# Altium schematic sheet Power.SchDoc: Power Supply
size B; Revision: B01; SheetNumber: 2; SheetTotal: 5; ProjectCodeName: HiFive1; ProjectName: Cinque
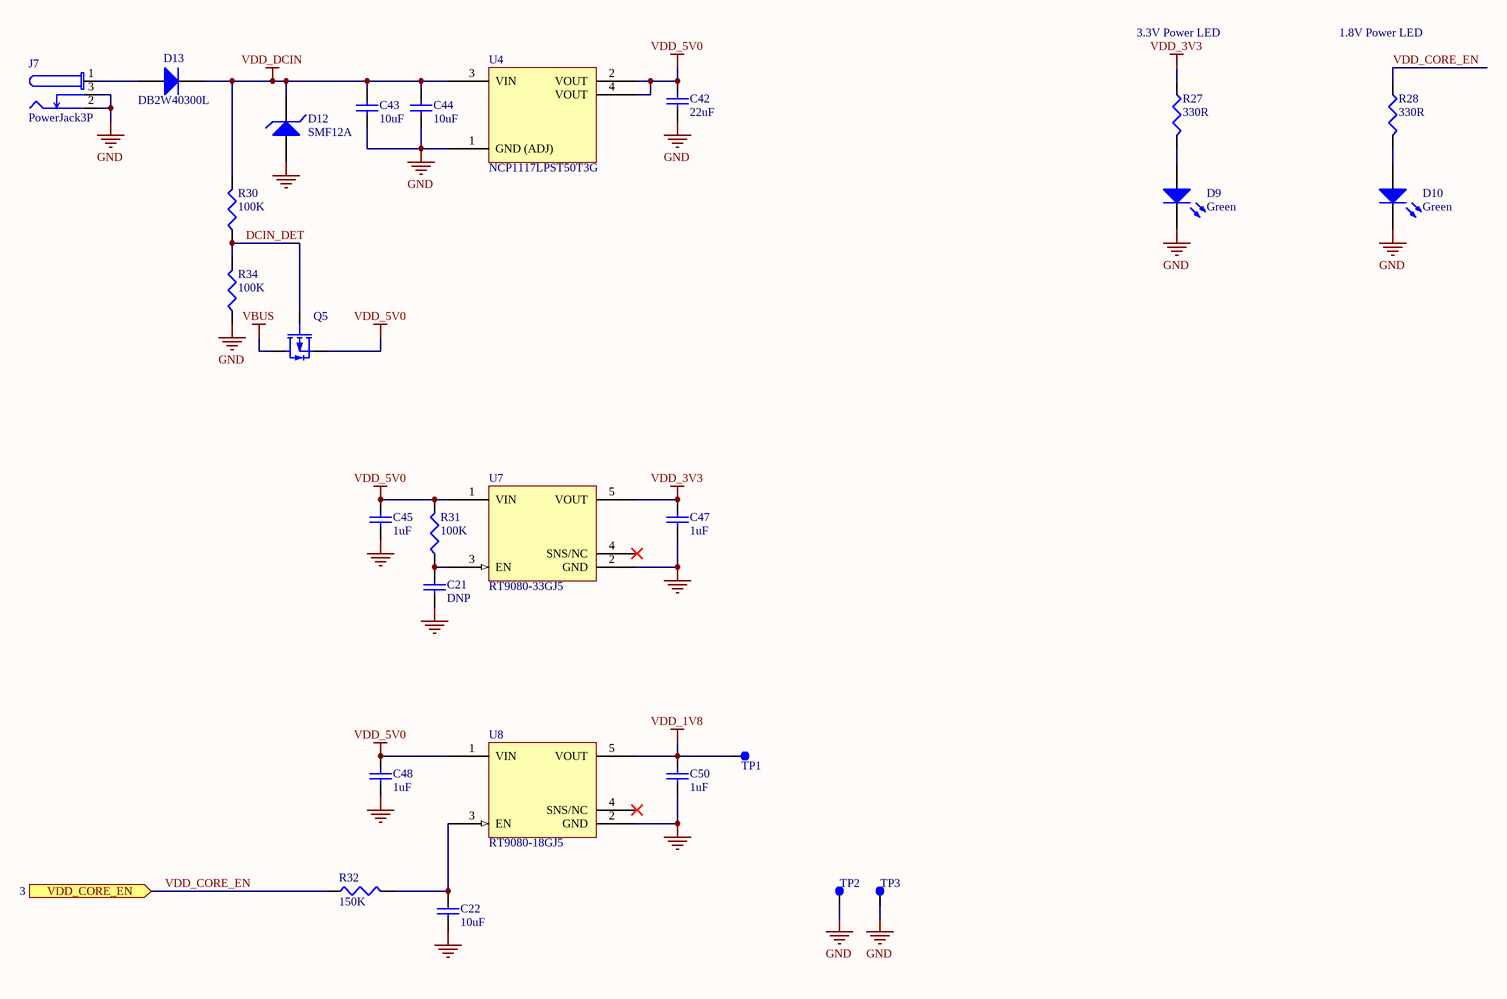
[diagram p0: Power.SchDoc]

## Parts
C21  DNP  [C0603]  (no BOM)
C22  10uF  [C0603]
C42  22uF  [C0805]
C43  10uF  [C0805]
C44  10uF  [C0805]
C45  1uF  [C0603]
C47  1uF  [C0603]
C48  1uF  [C0603]
C50  1uF  [C0603]
D9  Green  [LED0805]
D10  Green  [LED0805]
D12  SMF12A  [SOD-123FL]
D13  DB2W40300L  [SOD-123FL]
J7  PowerJack3P  [PJ-102AH]
Q5  MOSFET-P_SOT23  [SOT-23B]  (value not drawn)
R27  330R  [R0402]
R28  330R  [R0402]
R30  100K  [R0402]
R31  100K  [R0402]
R32  150K  [R0402]
R34  100K  [R0402]
TP1  Testpoint  [Testpoint_SMT]  (value not drawn)  (no BOM)
TP2  Testpoint  [Testpoint_SMT]  (value not drawn)  (no BOM)
TP3  Testpoint  [Testpoint_SMT]  (value not drawn)  (no BOM)
U4  NCP1117LPST50T3G  [SOT223P700X180-4N]
U7  RT9080-33GJ5  [TSOT23-5]
U8  RT9080-18GJ5  [TSOT23-5]

## Ports
VDD_CORE_EN (in, see 3)

## Nets
GND: C21.2 C22.2 C42.2 C43.2 C44.2 C45.2 C47.2 C48.2 C50.2 D9.1(K) D10.1(K) D12.2(A) J7.2 J7.3 R34.1 TP2.1 TP3.1 U4.1(GND_(ADJ)) U7.2(GND) U8.2(GND)
VBUS: Q5.3(D)
VDD_1V8: C50.1 TP1.1 U8.5(VOUT)
VDD_3V3: C47.1 R27.1 U7.5(VOUT)
VDD_5V0: C42.1 C45.1 C48.1 Q5.2(S) R31.2 U4.2(VOUT) U4.4(VOUT) U7.1(VIN) U8.1(VIN)
VDD_DCIN: C43.1 C44.1 D12.1(K) D13.1(K) R30.2 U4.3(VIN)
DCIN_DET: Q5.1(G) R30.1 R34.2
VDD_CORE_EN: R28.1 R32.1 ; port VDD_CORE_EN
NetC21_1: C21.1 R31.1 U7.3(EN)
NetC22_1: C22.1 R32.2 U8.3(EN)
NetD9_2: D9.2(A) R27.2
NetD10_2: D10.2(A) R28.2
NetD13_2: D13.2(A) J7.1

Not connected (* = marked no-connect by the designer): U7 4(SNS/NC)*; U8 4(SNS/NC)*

## Notes on the sheet
- 3.3V Power LED
- 1.8V Power LED
- Title
- Size:
- Date:
- B
- Proj:
- Revision:
- Sheet
- of
- File:

## Library data of the parts
C21 = C0100007: 10µF 6.3V Ceramic Capacitor X5R 0603; Manufacturer: Murata Electronics; Manufacturer PN: GRM188R60J106ME47J; Value: 10uF; Tolerance: ±10%; Part Number: C0100007; Type: X5R; Voltage Rating: 6.3V; Operating Temperature: -55°C ~ 85°C
C22 = C0100033: CAP CER 10UF 10V X5R 0603; Manufacturer: Murata Electronics; Manufacturer PN: GRM188R61A106KE69J; Tolerance: ±10%; Part Number: C0100033; Value: 10uF; Type: X5R; Voltage Rating: 10V; Operating Temperature: -55°C ~ 85°C
C42 = C0100010: 22µF 6.3V Ceramic Capacitor X5R 0805; Manufacturer: Murata Electronics; Manufacturer PN: GRM21BR60J226ME39L; Tolerance: ±20%; Part Number: C0100010; Value: 22uF; Type: X5R; Voltage Rating: 6.3V; Operating Temperature: -55°C ~ 85°C
C43 C44 = C0100015: 10µF ±10% 25V Ceramic Capacitor X5R 0805; Manufacturer: Murata Electronics; Manufacturer PN: GRM21BR61E106KA73L; Part Number: C0100015; Value: 10uF; Type: X5R; Voltage Rating: 25V; Tolerance: ±10%; Operating Temperature: -55°C ~85°C
C45 C47 C48 C50 = C0100006: 1µF 16V Ceramic Capacitor X5R 0603; Manufacturer: Murata Electronics; Manufacturer PN: GRM188R61C105KA93D; Tolerance: ±10%; Part Number: C0100006; Value: 1uF; Type: X5R; Voltage Rating: 16V; Operating Temperature: -55°C ~ 85°C
D9 D10 = E0000001: Green 570nm LED Indication - Discrete 2.2V 0805; Manufacturer: OSRAM Opto Semiconductors Inc; Manufacturer PN: LG R971-KN-1; Part Number: E0000001; Value: Green; Temperature Range: -65°C ~ 150°C; Voltage Forward: 2.2V
D12 = D0000002: TVS DIODE 12VWM 19.9VC SOD123; Manufacturer: Littelfuse Inc; Voltage Reverse Standoff: 12V; Voltage Breakdown: 13.3V; Voltage Reverse Clamping: 19.9V; Part Number: D0000002; Value: SMF12A; Manufacturer PN: SMF12A; Temperature Range: -55°C ~ 150°C
D13 = D0000006: Diode Schottky 40V 3A (DC) Surface Mount; Manufacturer: Panasonic Electronic Components; Voltage Forward: 0.54V@3A; Part Number: D0000006; Value: DB2W40300L; Manufacturer PN: DB2W40300L; Temperature Range: -65°C ~ 150°C
J7 = J0000003: Power Barrel Connector Jack 2.00mm ID (0.079"), 5.50mm OD (0.217") Through Hole, Right Angle; Manufacturer: CUI Inc; Part Number: J0000003; Manufacturer PN: PJ-102AH
Q5 = Q0000005: MOSFET P-CH 20V 4.2A SOT23; Manufacturer: Diodes Inc; Manufacturer PN: DMG2305UX-13; Value: P-Channel; Part Number: Q0000005; Temperature Range: -55°C ~ 150°C
R27 R28 = R0000026: RES SMD 330 OHM 1% 1/16W 0402; Manufacturer: Yageo; Manufacturer PN: RC0402FR-07330RL; Power Rating: 0.063W; Part Number: R0000026; Value: 330R; Tolerance: ±1%; Type: Thick Film; Temperature Range: -55°C ~ 155°C
R30 R31 R34 = R0000012: RES SMD 100K OHM 1% 1/16W 0402; Manufacturer: Yageo; Manufacturer PN: RC0402FR-07100KL; Power Rating: 0.063W; Part Number: R0000012; Value: 100K; Tolerance: ±1%; Type: Thick Film; Temperature Range: -55°C ~ 155°C
R32 = R0000055: RES SMD 150K OHM 1% 1/16W 0402; Manufacturer: Yageo; Manufacturer PN: RC0402FR-07150KL; Power Rating: 0.063W; Part Number: R0000055; Value: 150K; Tolerance: ±1%; Type: Thick Film; Temperature Range: -55°C ~ 155°C
TP1-TP3 = M0000002: Test Point SMT; Part Number: M0000002
U4 = U0000051: IC REG LINEAR 5V 1A SOT223; Manufacturer: ON Semiconductor; Part Number: U0000051; Value: NCP1117LPST50T3G; Manufacturer PN: NCP1117LPST50T3G; Temperature Range: -0°C ~ 125°C
U7 = U0000066: Linear Voltage Regulator IC Positive Fixed 1 Output 3.3V 600mA TSOT-23-5; Manufacturer: Richtek USA; Part Number: U0000066; Value: RT9080-33GJ5; Manufacturer PN: RT9080-33GJ5; Temperature Range: -40°C ~ 85°C
U8 = U0000065: Linear Voltage Regulator IC Positive Fixed 1 Output 1.8V 600mA TSOT-23-5; Manufacturer: Richtek USA; Part Number: U0000065; Value: RT9080-18GJ5; Manufacturer PN: RT9080-18GJ5; Temperature Range: -40°C ~ 85°C